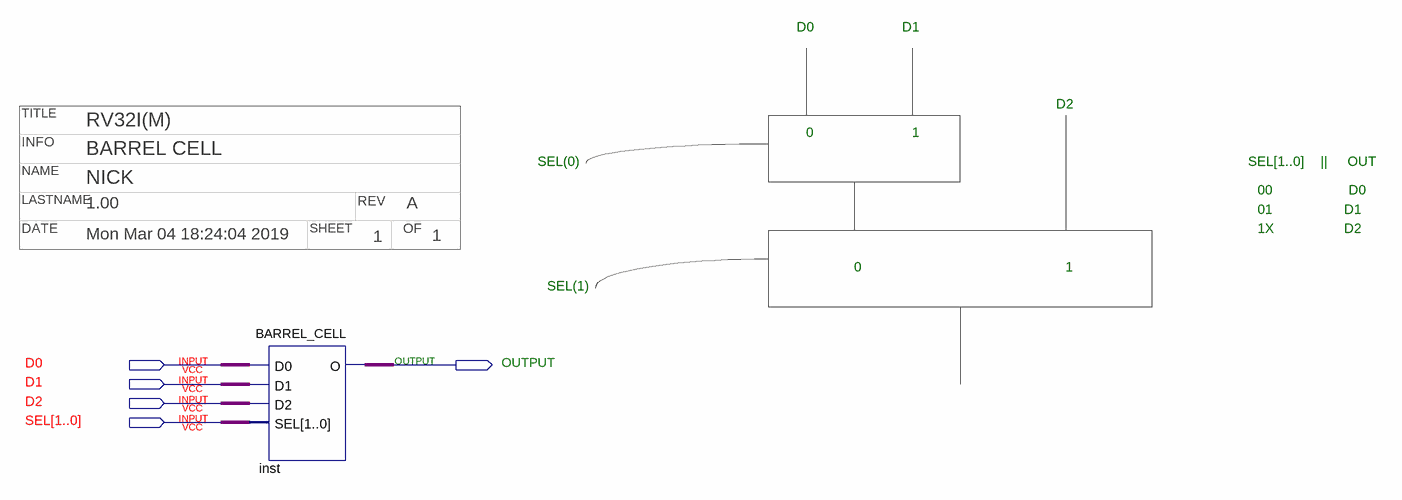
[diagram p0: schematic sheet]
// Quartus schematic BARREL_CELLTEST.bdf as structural Verilog: 1 symbols, 5 pins
// Title block: TITLE: RV32I(M); INFO: BARREL CELL; NAME: NICK; LASTNAME: 1.00; REV: A; DATE: Mon Mar 04 18:24:04 2019; SHEET: 1; OF: 1
module BARREL_CELLTEST (
  input  D0,
  input  D1,
  input  D2,
  input  [1:0] SEL,
  output OUTPUT
);

  BARREL_CELL inst (.D0(D0), .D1(D1), .D2(D2), .SEL(SEL), .O(OUTPUT));

  // Notes on the sheet:
  //   D0
  //   D1
  //   D2
  //   0
  //   1
  //   SEL(0)
  //   SEL[1..0]    ||     OUT
  //   00                   D0
  //   01
  //   D1
  //   1X
  //   D2
  //   0
  //   1
  //   SEL(1)
endmodule
